# EasyEDA Pro project PCB-WirelessCharging.eprj

# Schematic Schematic1
Board Name: Board1; Create Date: 2025-05-07
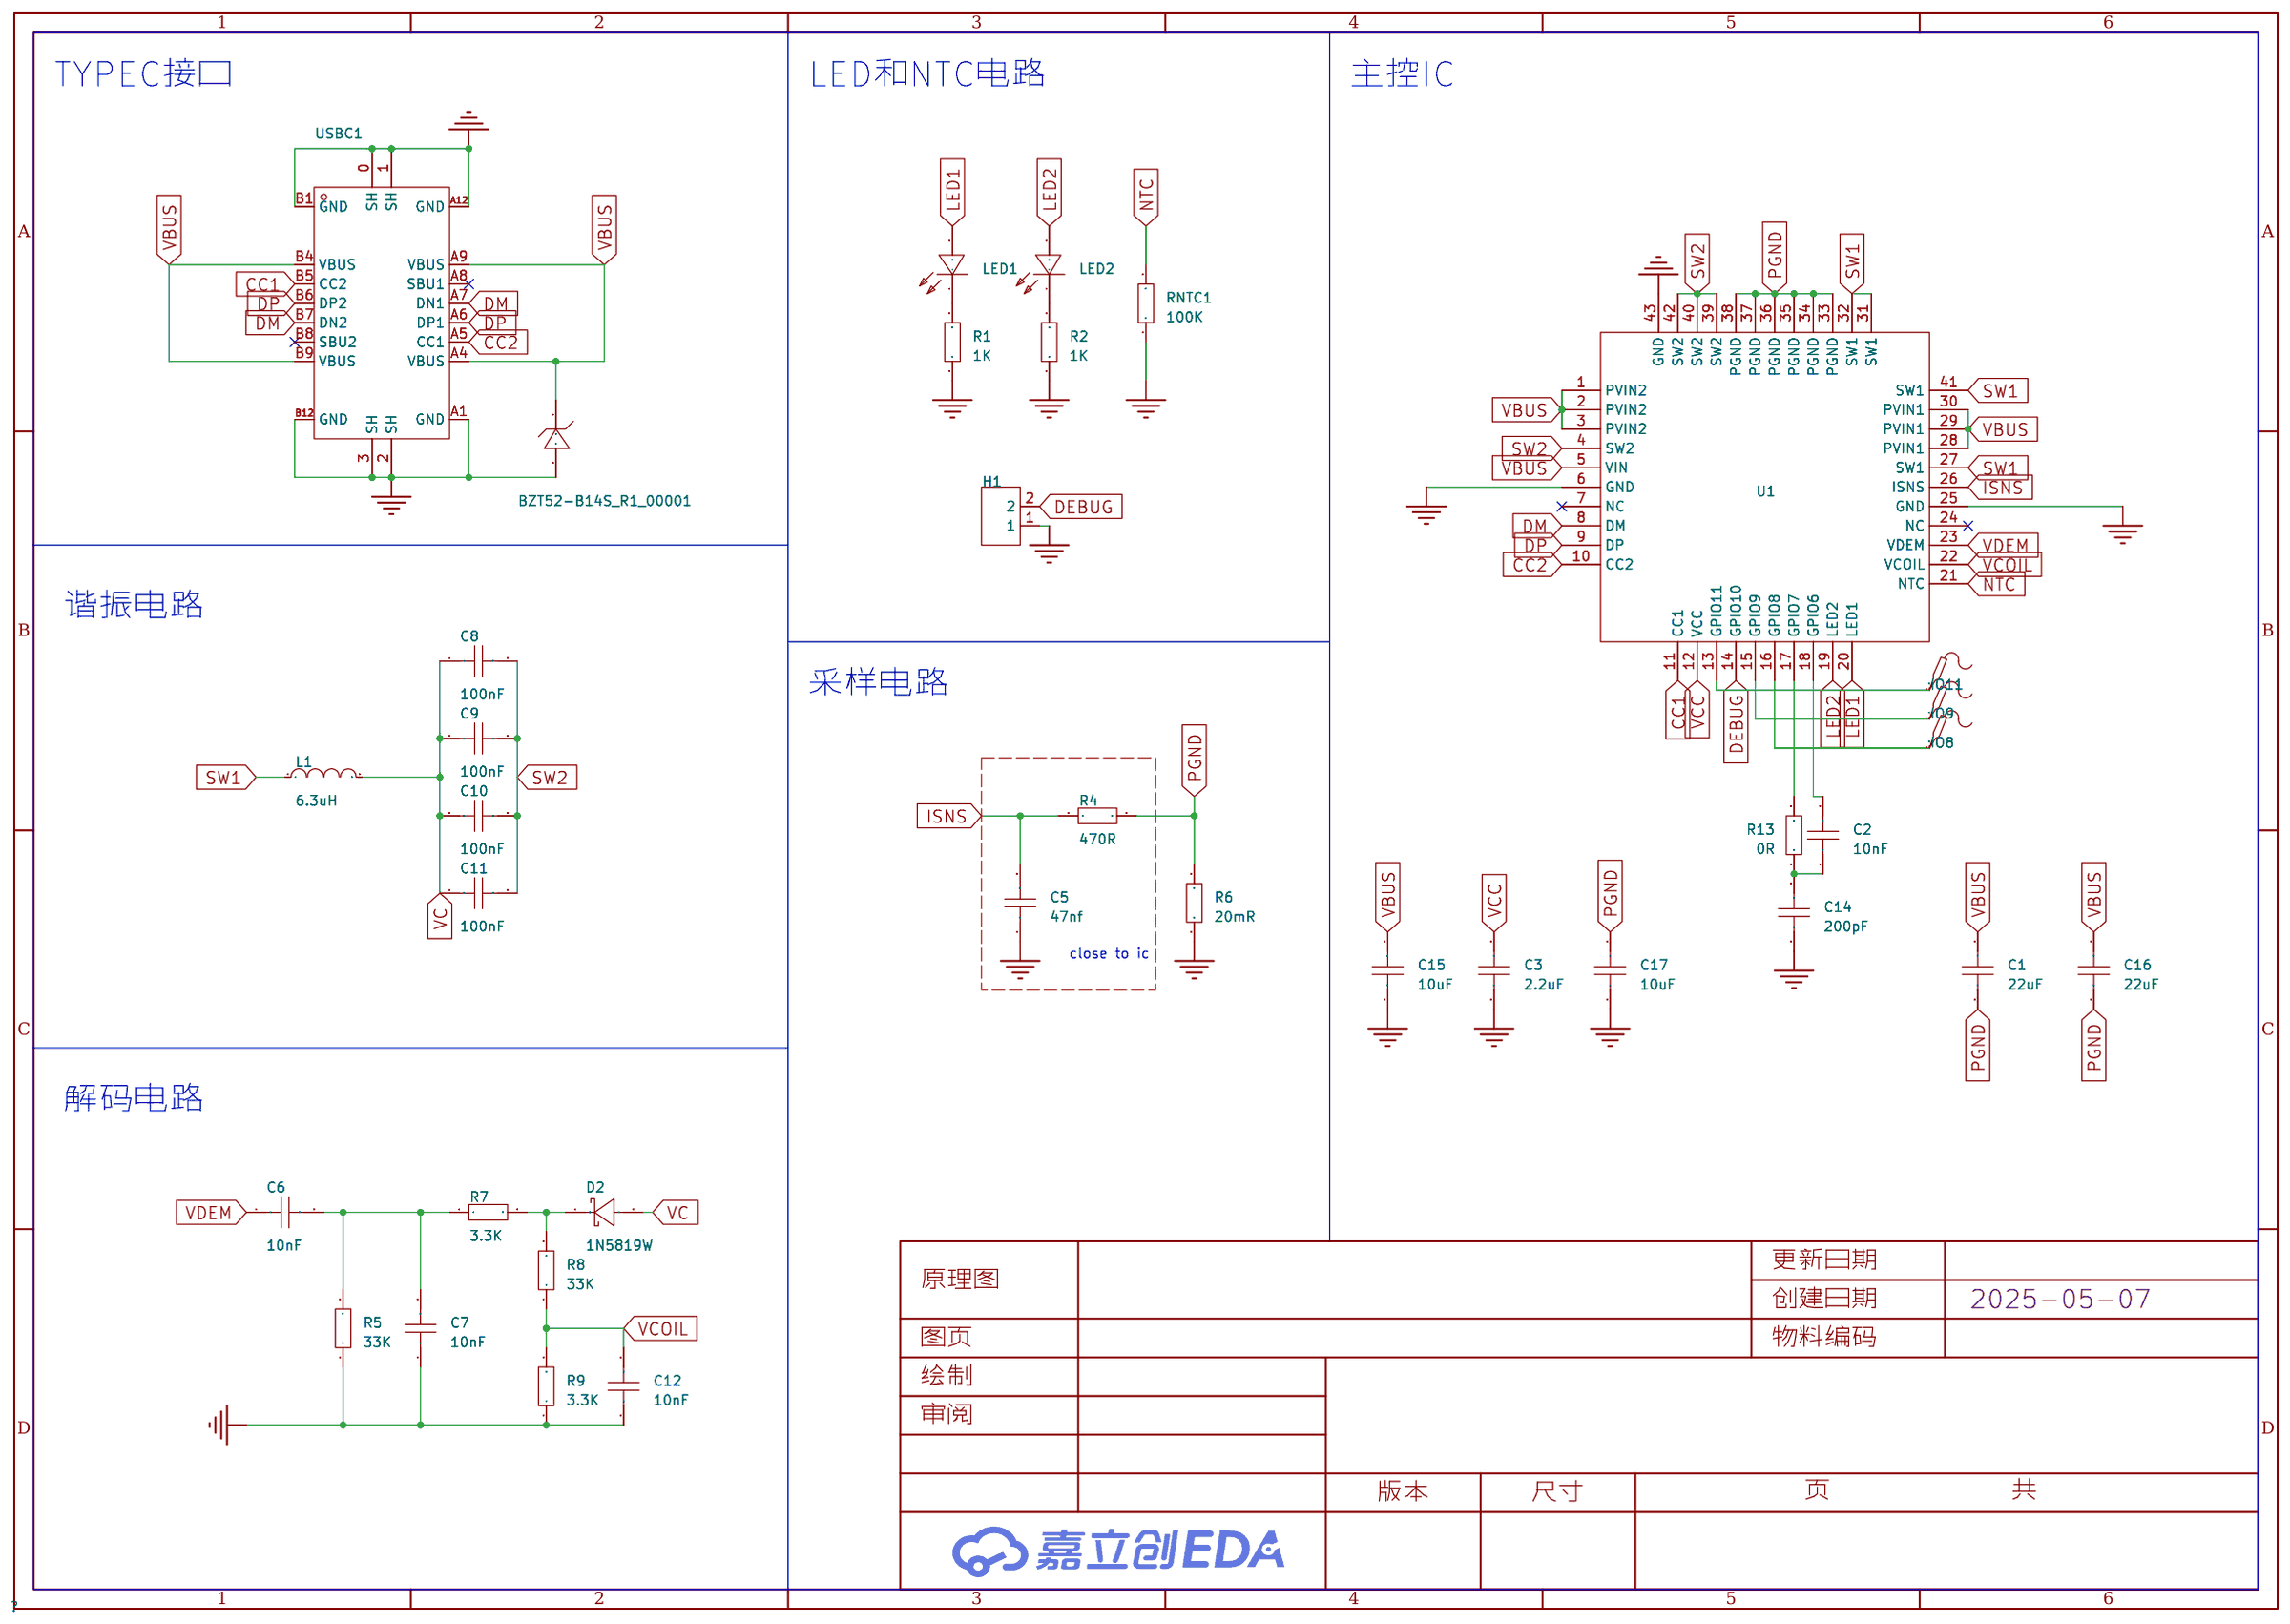
[diagram p0: schematic sheet]

## Parts
C1  22uF  [C0805]
C2  10nF  [C0603]
C3  2.2uF  [C0603]
C5  47nf  [C0603]
C6  10nF  [C0603]
C7  10nF  [C0603]
C8  100nF  [C1206]
C9  100nF  [C1206]
C10  100nF  [C1206]
C11  100nF  [C1206]
C12  10nF  [C0603]
C14  200pF  [C0603]
C15  10uF  [C0603]
C16  22uF  [C0805]
C17  10uF  [C0603]
D1  BZT52-B14S_R1_00001  [SOD-323_L1.9-W1.3-LS2.5-RD-1]
D2  1N5819W  [SOD-123_L2.7-W1.6-LS3.7-RD]
H1  PZ254V-11-02P  [HDR-TH_2P-P2.54-V-M]
IO8  -  [Test-Point-0.5mm]
IO9  -  [Test-Point-0.5mm]
IO11  -  [Test-Point-0.5mm]
L1  6.3uH  [IND-SMD_L4.5-W3.0]
LED1  LTST-C190KSKT  [LED0603-RD]
LED2  LTST-C190KSKT  [LED0603-RD]
R1  1K  [R0603]
R2  1K  [R0603]
R4  470R  [R0603]
R5  33K  [R0603]
R6  20mR  [R1206_1]
R7  3.3K  [R0603]
R8  33K  [R0603]
R9  3.3K  [R0603]
R13  0R  [R0603]
RNTC1  100K  [R0603]
U1  -  [IP6824]
USBC1  TYPE-C-31-M-12  [USB-C_SMD-TYPE-C-31-M-12]

## Library data of the parts
C1-C3 C5-C12 C14-C17 = CAP_0603: Supplier Footprint: 0603
D1 = BZT52-B14S_R1_00001: Supplier Part: C393420; Manufacturer: PANJIT(强茂); Supplier Footprint: SOD-323; JLCPCB Part Class: 扩展库; Datasheet: https://atta.szlcsc.com/upload/public/pdf/source/20190515/C393420_C734830DD542296BD43D073F6F92D8B1.pdf; Supplier: LCSC; Diode Configuration: 独立式; Zener Voltage (Nom): 14V; Reverse Leakage Current (Ir): 100nA@10.5V; Zener Voltage (Range): 13.72V~14.28V; Power Dissipation: 200mW; Zener Impedance (Zzt): 25Ω; Tolerance: ±2%
D2 = 1N5819W_C963381: LCSC Part Name: 电压:40V 电流:350mA; Supplier Part: C963381; Manufacturer: JSMSEMI(杰盛微); Supplier Footprint: SOD-123; JLCPCB Part Class: 扩展库; Datasheet: https://atta.szlcsc.com/upload/public/pdf/source/20230807/ADD53622154D5B572F84A7B877E922CE.pdf; Supplier: LCSC; Diode Configuration: 独立式; Forward Voltage (Vf@If): 600mV@200mA; Reverse Voltage (Vr): 40V; Rectified Current: 350mA; Reverse Leakage Current (Ir): 5uA@30V
H1 = PZ254V-11-02P: LCSC Part Name: 1x2P 间距:2.54mm 方针 直插; Supplier Part: C492401; Manufacturer: XFCN(兴飞); Supplier Footprint: 插件,P=2.54mm; JLCPCB Part Class: 扩展库; Datasheet: https://atta.szlcsc.com/upload/public/pdf/source/20200309/C492401_A812433581A9B211A7FFA413ADDFF0E5.pdf; Supplier: LCSC; Pin Structure: 1x2P; Pitch: 2.54mm; Circluar Pins/Square Pins: 方针; Mounting Type: 直插; Number of Rows: 单排; Number of Pins: 2P; Length of Mating Pin: 6mm; Insulation Height: 2.5mm; Length of End Connection Pin: 3mm; Contact Material: 黄铜; Operating Temperature: -40℃~+105℃; Color: 黑色
IO8 IO9 IO11 = Test-Point
L1 = L_0603: Supplier Footprint: L0603
LED1 LED2 = LTST-C190KSKT: LCSC Part Name: 黄灯; Supplier Part: C125095; Manufacturer: LITEON(光宝); Supplier Footprint: 0603; JLCPCB Part Class: 扩展库; Datasheet: https://atta.szlcsc.com/upload/public/pdf/source/20180129/C125095_15171881843821315881.pdf; Supplier: LCSC; Emitted Color: 黄色; Forward Voltage (VF): 2.1V; Power Dissipation: 75mW; Forward Current: 20mA; Dominant Wavelength: 584.5nm~597nm; Peak Wavelength: 588nm; Lens Color: 无色透明透镜; Luminous Intensity: 104mcd; Viewing Angle: 130°; Operating Temperature: -30℃~+85℃
R1 R2 R4-R9 R13 RNTC1 = Res_0603: Supplier Footprint: 0603
U1 = IP6824
USBC1 = TYPE-C-31-M-12: LCSC Part Name: Type-C 母; Supplier Part: C165948; Manufacturer: 韩国韩荣; Supplier Footprint: SMD; JLCPCB Part Class: 扩展库; Datasheet: https://atta.szlcsc.com/upload/public/pdf/source/20220525/466408E853115E789EDB0DDC29077C05.pdf; Supplier: LCSC; Connector Type: Type-C; Gender: 母; Number of Contacts: 16P; Number of Ports: 1; Current Rating - Power (Max): 5A

## Nets
GND: C3.1 C5.1 C7.1 C12.1 C14.1 C15.1 C17.1 D1.2(A) H1.1 R1.1 R2.1 R5.1 R6.1 R9.1 RNTC1.1 U1.6(GND) U1.25(GND) U1.43(GND) USBC1.0(SH) USBC1.1(SH) USBC1.2(SH) USBC1.3(SH) USBC1.A1(GND) USBC1.A12(GND) USBC1.B1(GND) USBC1.B12(GND)
PGND: C1.1 C16.1 C17.2 R4.2 R6.2 U1.33(PGND) U1.34(PGND) U1.35(PGND) U1.36(PGND) U1.37(PGND) U1.38(PGND)
VBUS: C1.2 C15.2 C16.2 D1.1(C) U1.1(PVIN2) U1.2(PVIN2) U1.3(PVIN2) U1.5(VIN) U1.28(PVIN1) U1.29(PVIN1) U1.30(PVIN1) USBC1.A4(VBUS) USBC1.A9(VBUS) USBC1.B4(VBUS) USBC1.B9(VBUS)
VCC: C3.2 U1.12(VCC)
CC1: U1.11(CC1) USBC1.B5(CC2)
CC2: U1.10(CC2) USBC1.A5(CC1)
DEBUG: H1.2 U1.14(GPIO10)
DM: U1.8(DM) USBC1.A7(DN1) USBC1.B7(DN2)
DP: U1.9(DP) USBC1.A6(DP1) USBC1.B6(DP2)
ISNS: C5.2 R4.1 U1.26(ISNS)
LED1: LED1.2(+) U1.20(LED1)
LED2: LED2.2(+) U1.19(LED2)
NTC: RNTC1.2 U1.21(NTC)
SW1: L1.1 U1.27(SW1) U1.31(SW1) U1.32(SW1) U1.41(SW1)
SW2: C8.2 C9.2 C10.2 C11.2 U1.4(SW2) U1.39(SW2) U1.40(SW2) U1.42(SW2)
VC: C8.1 C9.1 C10.1 C11.1 D2.2(A) L1.2
VCOIL: C12.2 R8.1 R9.2 U1.22(VCOIL)
VDEM: C6.1 U1.23(VDEM)
$1N1712: IO8.1 U1.16(GPIO8)
$1N1716: IO9.1 U1.15(GPIO9)
$1N1721: IO11.1 U1.13(GPIO11)
$1N1775: R13.2 U1.17(GPIO7)
$1N1830: C2.2 U1.18(GPIO6)
$1N1835: C2.1 C14.2 R13.1
$1N3496: C6.2 C7.2 R5.2 R7.1
$1N3523: D2.1(C) R7.2 R8.2
$1N4406: LED1.1(-) R1.2
$1N4454: LED2.1(-) R2.2

Not connected (* = marked no-connect by the designer): U1 7(NC)* 24(NC)*; USBC1 A8(SBU1)* B8(SBU2)*

## Notes on the sheet
- TYPEC接口
- LED和NTC电路
- 主控IC
- 谐振电路
- 采样电路
- close to ic
- 解码电路

# Schematic Schematic2
Board Name: 接收端; Create Date: 2025-06-30
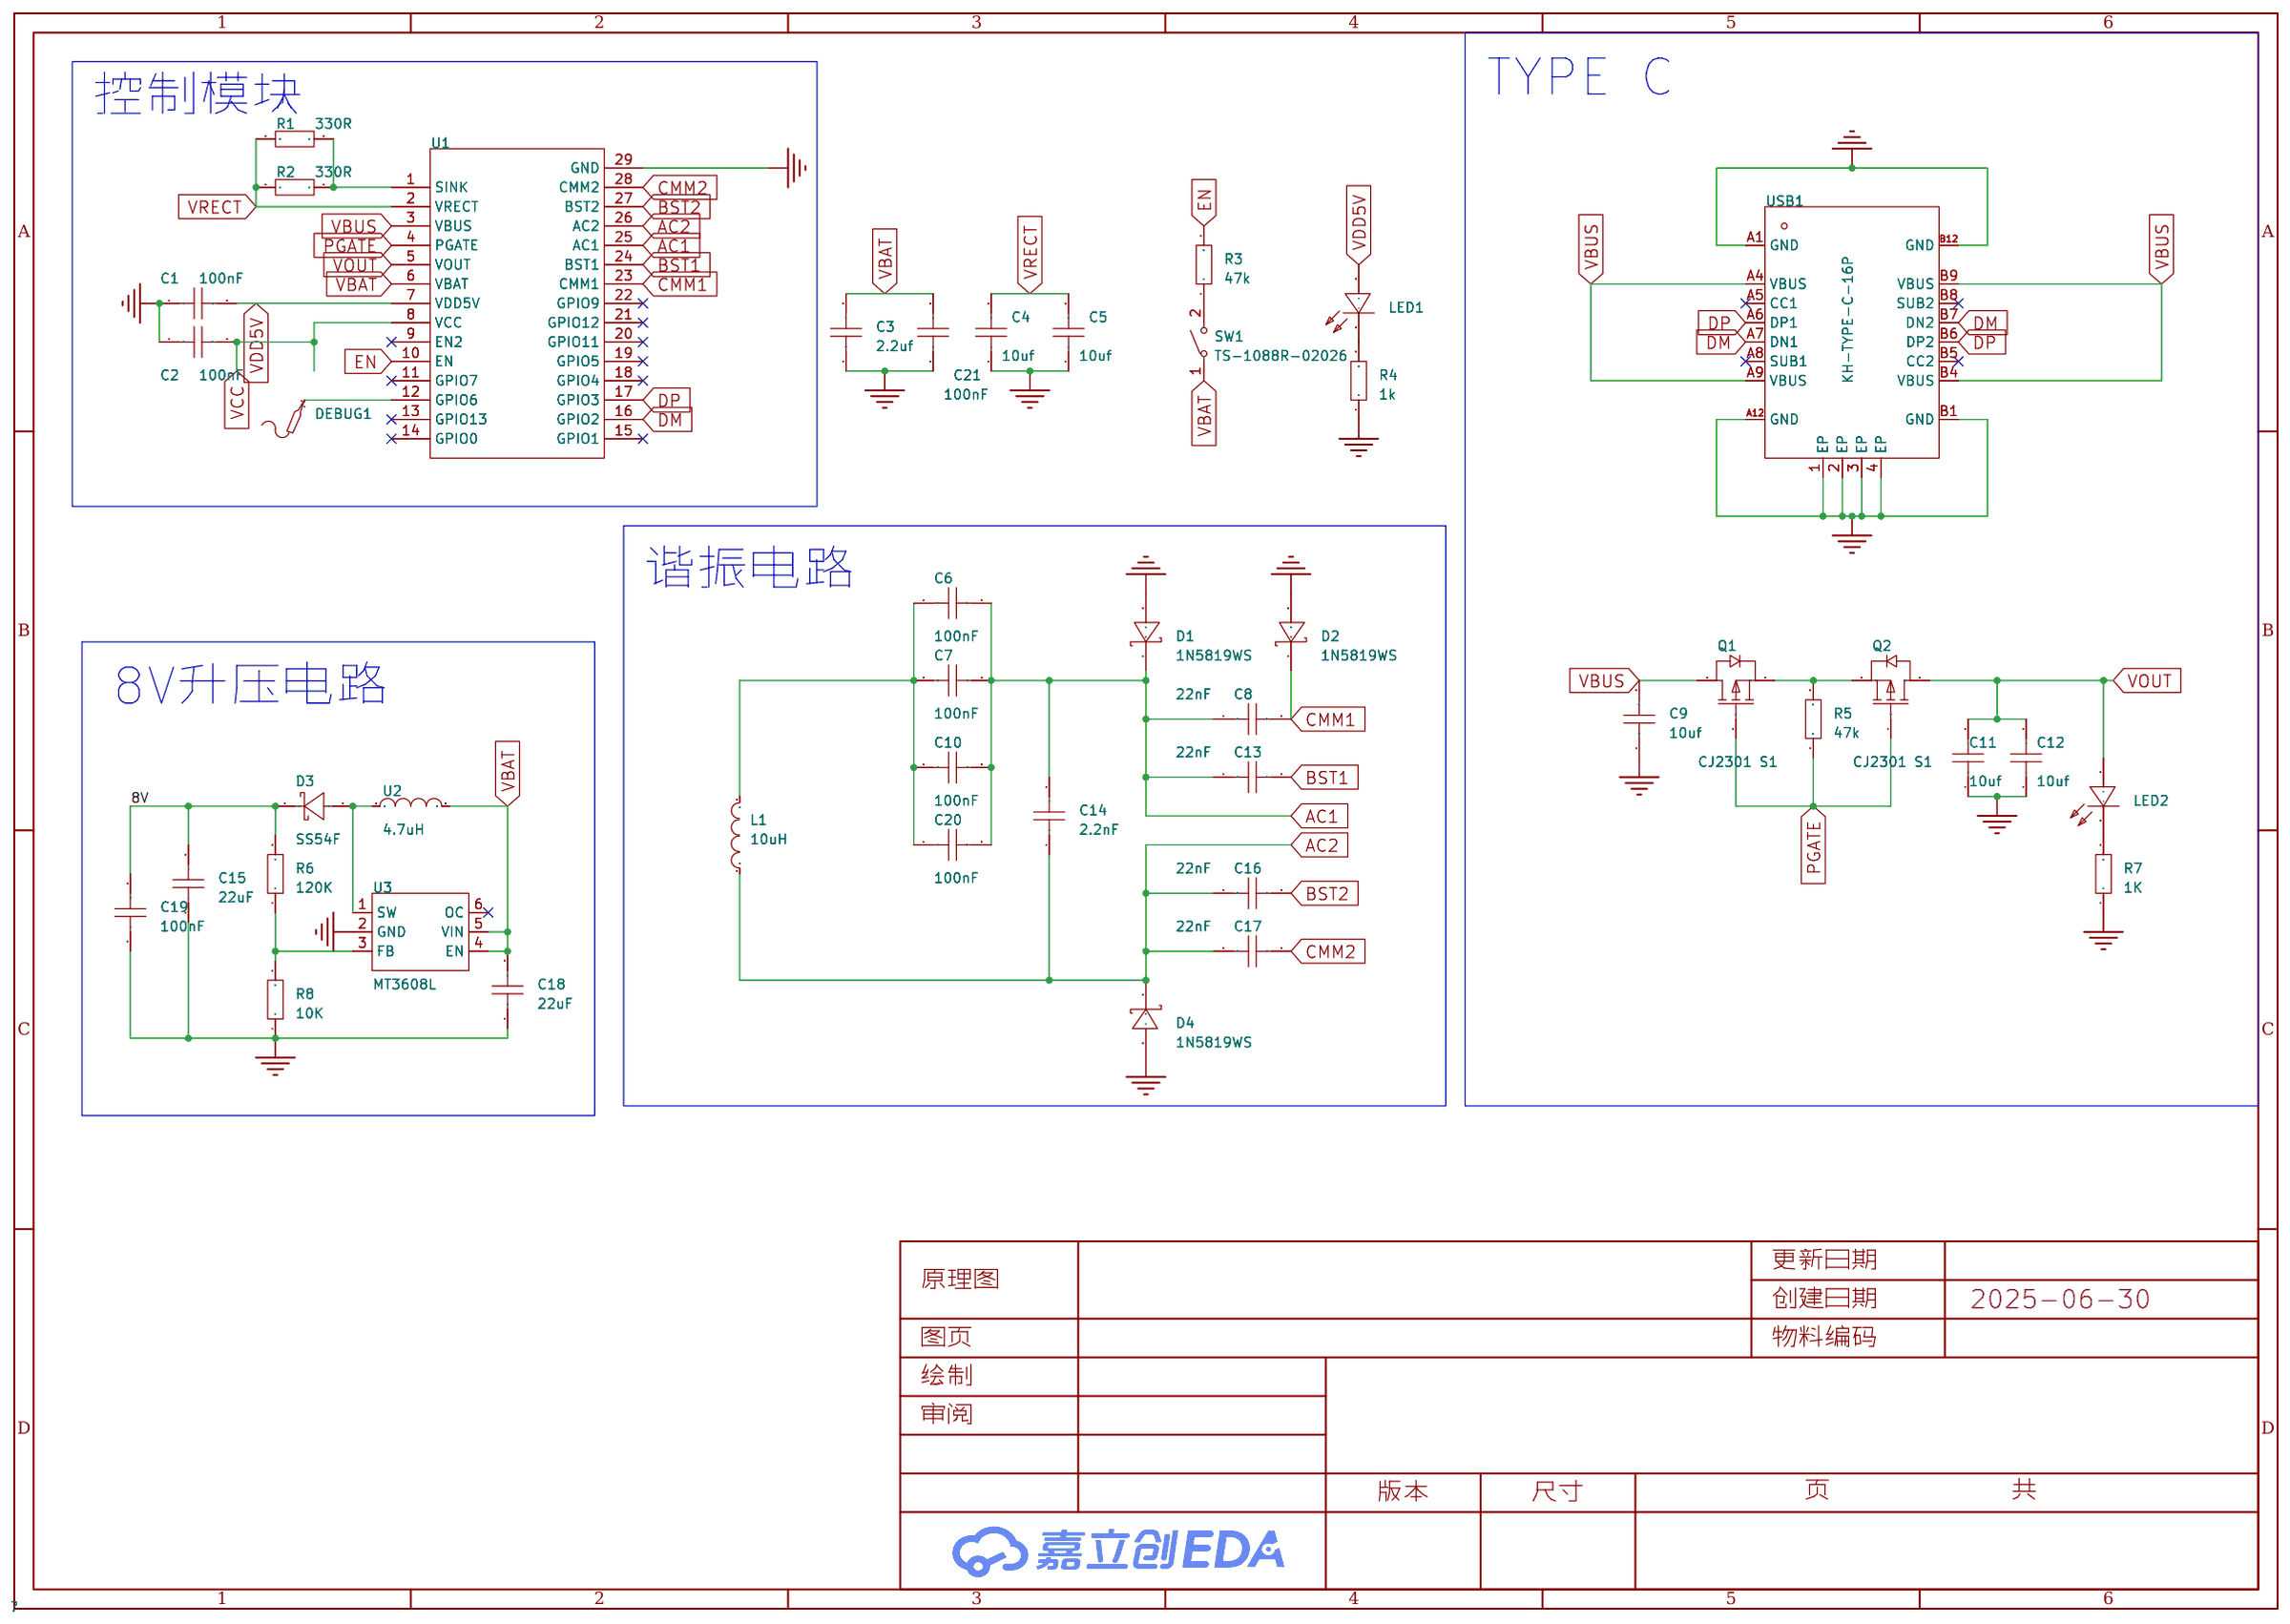
[diagram p1: schematic sheet]

## Parts
C1  100nF  [C0603]
C2  100nF  [C0603]
C3  2.2uf  [C0603]
C4  10uf  [C0603]
C5  10uf  [C0603]
C6  100nF  [C0603]
C7  100nF  [C0603]
C8  22nF  [C0603]
C9  10uf  [C0603]
C10  100nF  [C0603]
C11  10uf  [C0603]
C12  10uf  [C0603]
C13  22nF  [C0603]
C14  2.2nF  [C0603]
C15  22uF  [C0805]
C16  22nF  [C0603]
C17  22nF  [C0603]
C18  22uF  [C0805]
C19  100nF  [C0603]
C20  100nF  [C0603]
C21  100nF  [C0603]
D1  1N5819WS  [SOD-323_L1.8-W1.3-LS2.5-RD]
D2  1N5819WS  [SOD-323_L1.8-W1.3-LS2.5-RD]
D3  SS54F  [SMAF_L3.5-W2.6-LS4.7-RD-1]
D4  1N5819WS  [SOD-323_L1.8-W1.3-LS2.5-RD]
DEBUG1  -  [Test-Point-0.5mm]
L1  10uH  [L0603]
LED1  LTST-C190KSKT  [LED0603-RD]
LED2  LTST-C190KSKT  [LED0603-RD]
Q1  CJ2301 S1  [SOT-23-3_L3.0-W1.7-P0.95-LS2.9-BR]
Q2  CJ2301 S1  [SOT-23-3_L3.0-W1.7-P0.95-LS2.9-BR]
R1  330R  [R0805]
R2  330R  [R0805]
R3  47k  [R0603]
R4  1k  [R0603]
R5  47k  [R0603]
R6  120K  [R0603]
R7  1K  [R0603]
R8  10K  [R0603]
SW1  TS-1088R-02026  [SW-SMD_L3.9-W3.0-P4.45]
U1  -  [IP6833]
U2  4.7uH  [IND-SMD_L4.4-W4.2]
U3  MT3608L  [SOT-23-6_L2.9-W1.6-P0.95-LS2.8-BL_3]
USB1  KH-TYPE-C-16P  [USB-C-SMD_KH-TYPE-C-16P]

## Library data of the parts
C1-C21 = CAP_0603: Supplier Footprint: 0603
D1 D2 D4 = 1N5819WS_C191023: LCSC Part Name: 电压:40V 电流:1A; Supplier Part: C191023; Manufacturer: Hottech(合科泰); Supplier Footprint: SOD-323; JLCPCB Part Class: 基础库; Datasheet: https://atta.szlcsc.com/upload/public/pdf/source/20220428/3CB86FD8D28D653594B4E35F9D5AEFD9.pdf; Supplier: LCSC; Forward Voltage (Vf@If): 600mV@1A; Reverse Voltage (Vr): 40V; Rectified Current: 1A
D3 = SS54F_C18199179: LCSC Part Name: 电压:40V 电流:5A; Supplier Part: C18199179; Manufacturer: 宏嘉诚; Supplier Footprint: SMAF; JLCPCB Part Class: 扩展库; Datasheet: https://atta.szlcsc.com/upload/public/pdf/source/20250121/FDB92513849E10B53DCF948A58635644.pdf; Supplier: LCSC; Diode Configuration: 独立式; Voltage - Forward(Vf@If): 550mV@5.0A; Voltage - DC Reverse(Vr): 40V; Current - Rectified: 5A; Reverse Leakage Current (Ir): 200uA@40V
DEBUG1 = Test-Point
L1 = L_0603
LED1 LED2 = LTST-C190KSKT: LCSC Part Name: 黄灯; Supplier Part: C125095; Manufacturer: LITEON(光宝); Supplier Footprint: 0603; JLCPCB Part Class: 扩展库; Datasheet: https://atta.szlcsc.com/upload/public/pdf/source/20180129/C125095_15171881843821315881.pdf; Supplier: LCSC; Emitted Color: 黄色; Forward Voltage (VF): 2.1V; Power Dissipation: 75mW; Forward Current: 20mA; Dominant Wavelength: 584.5nm~597nm; Peak Wavelength: 588nm; Lens Color: 无色透明透镜; Luminous Intensity: 104mcd; Viewing Angle: 130°; Operating Temperature: -30℃~+85℃
Q1 Q2 = CJ2301 S1: LCSC Part Name: 1个P沟道 耐压:20V 电流:2.3A; Supplier Part: C8547; Manufacturer: CJ(江苏长电/长晶); Supplier Footprint: SOT-23; JLCPCB Part Class: 扩展库; Datasheet: https://atta.szlcsc.com/upload/public/pdf/source/20140815/1457707224119.pdf; Supplier: LCSC; Type: 1个P沟道; Drain to Source Voltage: 20V; Current - Continuous Drain(Id): 2.3A; RDS(on): 142mΩ@2.5V,2A; Pd - Power Dissipation: 350mW; Gate Threshold Voltage (Vgs(th)@Id): 1V; Input Capacitance(Ciss@Vds): 405pF@10V; Operating Temperature: -55℃~+150℃
R1-R8 = Res_0603: Supplier Footprint: 0603
SW1 = TS-1088R-02026: LCSC Part Name: 3.9*2.93*2mm 立贴 轻触开关; Supplier Part: C455280; Manufacturer: XUNPU(讯普); Supplier Footprint: SMD,3x4mm; JLCPCB Part Class: 扩展库; Datasheet: https://atta.szlcsc.com/upload/public/pdf/source/20191118/C455281_EC5379764BC1462550DF64BBBFEA9579.pdf; Supplier: LCSC; Circuit: 单刀单掷; Actuator Style: 圆形按钮; Mounting Style: 立贴; Switch Length: 3.9mm; Switch Width: 2.93mm; Switch Height: 2mm; Contact Current: 50mA; Voltage Rating (DC): 12V
U1 = IP6833
U2 = XR0420-4R7M: LCSC Part Name: 4.7uH ±20% 3A; Supplier Part: C5307591; Manufacturer: XR(祥如); Supplier Footprint: SMD,0420; JLCPCB Part Class: 扩展库; Datasheet: https://atta.szlcsc.com/upload/public/pdf/source/20240328/110B611B724D24AB51078DA8F677E482.pdf; Supplier: LCSC; Tolerance: ±20%; Current Rating: 2.8A; Current - Saturation(Isat): 3A; DC Resistance(DCR): 105mΩ; Type: 一体成型电感
U3 = MT3608L: LCSC Part Name: 高效2.5A 1.2MHz升压转换器; Supplier Part: C2932326; Manufacturer: 西安航天民芯; Supplier Footprint: SOT-23-6; JLCPCB Part Class: 扩展库; Datasheet: https://atta.szlcsc.com/upload/public/pdf/source/20211213/953A62CC1033762E00AABAD4906DD7F1.pdf; Supplier: LCSC; Function: 升压型; Output Type: 可调; Voltage - Supply: 2.2V~16V; Output Current: 2.5A; Frequency - Switching: 1.2MHz; Operating Temperature: -40℃~+85℃@(TA); Synchronous Rectifier: 否; Number of Outputs: 1; Topology: 升压式; Quiescent Current: 100uA; Switch tube (built-in/external): 内置
USB1 = KH-TYPE-C-16P: LCSC Part Name: Type-C 母 卧贴; Supplier Part: C709357; Manufacturer: kinghelm(金航标); Supplier Footprint: SMD; JLCPCB Part Class: 扩展库; Datasheet: https://atta.szlcsc.com/upload/public/pdf/source/20200911/C709357_AA8DCEB38BB20E3035A7ED7AE7667837.pdf; Supplier: LCSC; Connector Type: Type-C; Gender: 母; Number of Ports: 1; Number of Contacts: 16P; Mounting Style: 卧贴; Current Rating - Power (Max): 3A; Operating Temperature Range: -40℃~+85℃

## Nets
8V: C15.2 C19.2 D3.1(K) R6.2
GND: C1.1 C2.1 C3.1 C4.1 C5.1 C9.1 C11.1 C12.1 C15.1 C18.1 C19.1 C21.1 D1.2(A) D2.2(A) D4.2(A) R4.1 R7.1 R8.1 U1.29(GND) U3.2(GND) USB1.1(EP) USB1.2(EP) USB1.3(EP) USB1.4(EP) USB1.A1(GND) USB1.A12(GND) USB1.B1(GND) USB1.B12(GND)
VBAT: C3.2 C18.2 C21.2 SW1.1 U1.6(VBAT) U2.2 U3.4(EN) U3.5(VIN)
VBUS: C9.2 Q1.3(D) U1.3(VBUS) USB1.A4(VBUS) USB1.A9(VBUS) USB1.B4(VBUS) USB1.B9(VBUS)
VCC: C2.2 U1.8(VCC)
VDD5V: C1.2 LED1.2(+) U1.7(VDD5V)
AC1: C6.2 C7.2 C8.1 C10.2 C13.1 C14.2 C20.2 D1.1(K) U1.25(AC1)
AC2: C14.1 C16.1 C17.1 D4.1(K) L1.1 U1.26(AC2)
BST1: C13.2 U1.24(BST1)
BST2: C16.2 U1.27(BST2)
CMM1: C8.2 D2.1(K) U1.23(CMM1)
CMM2: C17.2 U1.28(CMM2)
DM: U1.16(GPIO2) USB1.A7(DN1) USB1.B7(DN2)
DP: U1.17(GPIO3) USB1.A6(DP1) USB1.B6(DP2)
EN: R3.2 U1.10(EN)
PGATE: Q1.1(G) Q2.1(G) R5.1 U1.4(PGATE)
VOUT: C11.2 C12.2 LED2.2(+) Q2.3(D) U1.5(VOUT)
VRECT: C4.2 C5.2 R1.2 R2.2 U1.2(VRECT)
$1N1926: R1.1 R2.1 U1.1(SINK)
$1N1936: DEBUG1.1 U1.12(GPIO6)
$1N1945: C6.1 C7.1 C10.1 C20.1 L1.2
$1N1962: Q1.2(S) Q2.2(S) R5.2
$1N1968: LED2.1(-) R7.2
$1N1977: LED1.1(-) R4.2
$1N1985: D3.2(A) U2.1 U3.1(SW)
$1N1994: R6.1 R8.2 U3.3(FB)
$1N3112: R3.1 SW1.2

Not connected (* = marked no-connect by the designer): U1 9(EN2)* 11(GPIO7)* 13(GPIO13)* 14(GPIO0)* 15(GPIO1)* 18(GPIO4)* 19(GPIO5)* 20(GPIO11)* 21(GPIO12)* 22(GPIO9)*; U3 6(OC)*; USB1 A5(CC1)* A8(SUB1)* B5(CC2)* B8(SUB2)*

## Notes on the sheet
- TYPE C
- 控制模块
- 谐振电路
- 8V升压电路

# Board PCB1
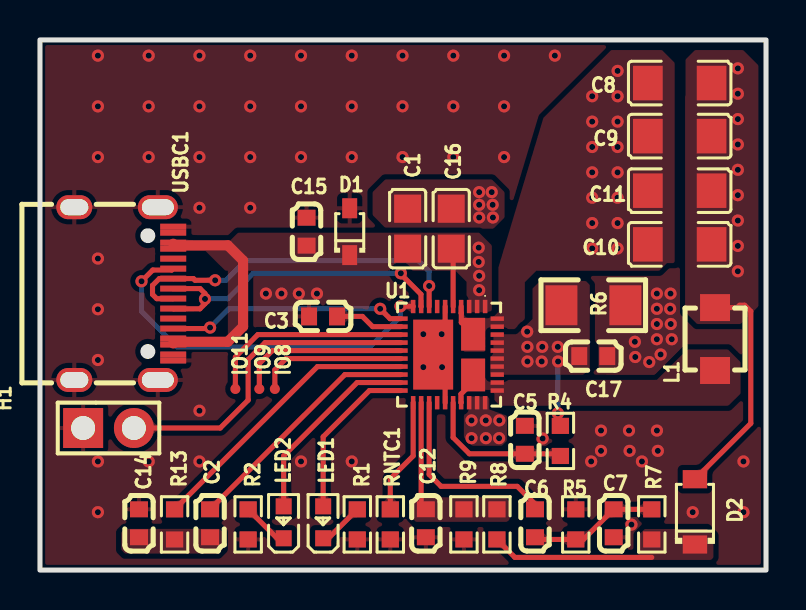
[diagram p2: board, top side]
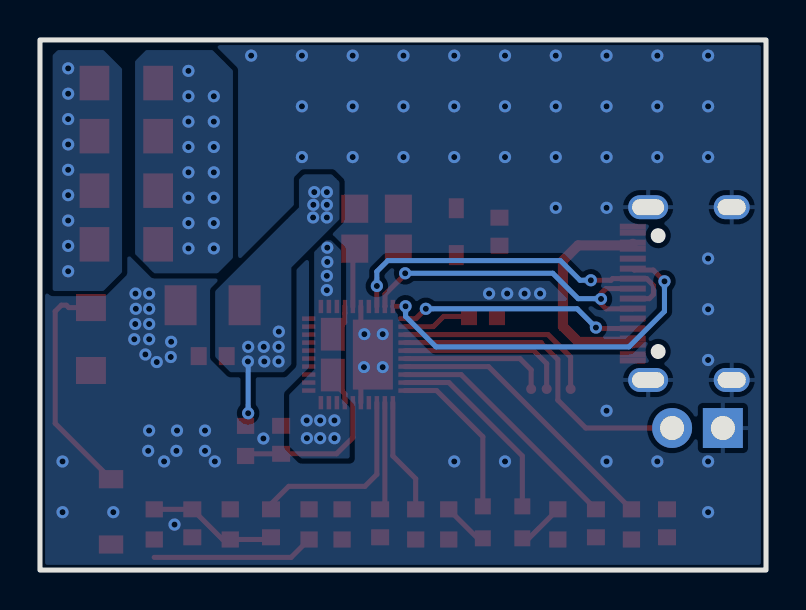
[diagram p3: board, bottom side, seen from below]

Outline 36.32 x 26.54 mm; copper layers: Top Layer, Bottom Layer. Coordinates in mm from the lower left corner of the outline.
Outline path: rectangle 0,26.54 36.32,0
Stack: Top Layer 0.035mm / Dielectric1 1.51mm FR4 er 4.5 / Bottom Layer 0.035mm

## Design rules (mm)
template: 自定义配置
spacing copperThickness1oz (default): track to track 0.102, other pairs 0.152 to 0.3
spacing copperThickness2oz: track to track 0.203, other pairs 0.152 to 0.3
track width copperThickness1oz (default): min 0.127, default 0.254, max 2.54
track width copperThickness2oz: min 0.203, default 0.254, max 2.54
differential pair differentialPair (default): width min 0.127, default 0.254, max 2.54; gap min 0.152, default 0.152
via viaSize (default): diameter min 0.5, default 0.61, max 10; hole min 0.3, default 0.305, max 6.3
pour e39 uses 直连
pour e98 uses 直连
pour e163 uses 直连
pour e203 uses 直连
pour e243 uses 直连
pour e281 uses 直连
pour e300 uses 直连
pour e367 uses 直连
pour e770 uses 直连
pour e1145 uses 直连
pour e1188 uses 直连
pour e1461 uses 直连

## Placement (name value [footprint] x y rotation side)
C1  22uF  [C0805]  18.39 17.09 270 top
C2  10nF  [C0603]  8.51 2.34 90 top
C3  2.2uF  [C0603]  14.16 12.7 0 top
C5  47nf  [C0603]  24.26 6.52 270 top
C6  10nF  [C0603]  24.76 2.34 270 top
C7  10nF  [C0603]  28.7 2.34 90 top
C8  100nF  [C1206]  32 24.38 180 top
C9  100nF  [C1206]  32 21.73 180 top
C10  100nF  [C1206]  32 16.31 180 top
C11  100nF  [C1206]  32 19 180 top
C12  10nF  [C0603]  19.3 2.34 90 top
C14  200pF  [C0603]  4.95 2.34 270 top
C15  10uF  [C0603]  13.34 16.94 270 top
C16  22uF  [C0805]  20.57 17.09 270 top
C17  10uF  [C0603]  27.68 10.71 180 top
D1  BZT52-B14S_R1_00001  [SOD-323_L1.9-W1.3-LS2.5-RD-1]  15.49 16.94 90 top
D2  1N5819W  [SOD-123_L2.7-W1.6-LS3.7-RD]  32.77 2.92 90 top
H1  PZ254V-11-02P  [HDR-TH_2P-P2.54-V-M]  3.43 7.11 0 top
IO8  -  [Test-Point-0.5mm]  11.75 9.07 0 top
IO9  -  [Test-Point-0.5mm]  10.97 9.07 0 top
IO11  -  [Test-Point-0.5mm]  9.78 9.07 0 top
L1  6.3uH  [IND-SMD_L4.5-W3.0]  33.77 11.57 90 top
LED1  LTST-C190KSKT  [LED0603-RD]  14.17 2.39 90 top
LED2  LTST-C190KSKT  [LED0603-RD]  12.19 2.39 90 top
R1  1K  [R0603]  15.88 2.29 90 top
R2  1K  [R0603]  10.41 2.29 90 top
R4  470R  [R0603]  26.03 6.47 90 top
R5  33K  [R0603]  26.81 2.29 270 top
R6  20mR  [R1206_1]  27.69 13.26 180 top
R7  3.3K  [R0603]  30.61 2.29 270 top
R8  33K  [R0603]  22.86 2.29 270 top
R9  3.3K  [R0603]  21.21 2.29 90 top
R13  0R  [R0603]  6.73 2.29 90 top
RNTC1  100K  [R0603]  17.53 2.29 90 top
U1  -  [IP6824]  20.47 10.79 270 top
USBC1  TYPE-C-31-M-12  [USB-C_SMD-TYPE-C-31-M-12]  4.19 13.84 270 top

## Footprints (pads in the part's own frame, mm; a bottom-side part is the same pattern mirrored in y, then rotated)
C0603
  rect 0.8x0.9 smd: 1(-0.7,0) 2(0.7,0)
C0805
  rect 1.41x1.35 smd: 1(-1,0) 2(1,0)
C1206
  rect 1.485x1.728 smd: 1(-1.593,0) 2(1.593,0)
HDR-TH_2P-P2.54-V-M
  rect 2x2 hole 1.2: 1(-1.27,0)
  round 2 hole 1.2: 2(1.27,0)
IND-SMD_L4.5-W3.0
  rect 1.35x1.5 smd: 1(-1.575,0) 2(1.575,0)
IP6824
  rect 0.665x0.224 smd: 1(-2.408,1.8) 2(-2.408,1.4) 3(-2.408,1) 4(-2.408,0.6) 5(-2.408,0.2) 6(-2.408,-0.2) 7(-2.408,-0.6) 8(-2.408,-1) 9(-2.408,-1.4) 10(-2.408,-1.8) 21(2.408,-1.8) 22(2.408,-1.4) 23(2.408,-1) 24(2.408,-0.6) 25(2.408,-0.2) 26(2.408,0.2) 27(2.408,0.6) 28(2.408,1) 29(2.408,1.4) 30(2.408,1.8)
  rect 0.224x0.665 smd: 11(-1.8,-2.408) 12(-1.4,-2.408) 13(-1,-2.408) 14(-0.6,-2.408) 15(-0.2,-2.408) 16(0.2,-2.408) 17(0.6,-2.408) 18(1,-2.408) 19(1.4,-2.408) 20(1.8,-2.408) 31(1.8,2.408) 32(1.4,2.408) 33(1,2.408) 34(0.6,2.408) 35(0.2,2.408) 36(-0.2,2.408) 37(-0.6,2.408) 38(-1,2.408) 39(-1.4,2.408) 40(-1.8,2.408)
  rect 1.64x1.2 smd: 41(1.02,1.2) 42(-1.02,1.2)
  rect 3.5x2 smd: 43(0,-0.8)
LED0603-RD
  rect 0.8x0.8 smd: 1(-0.799,0) 2(0.799,0)
R0603
  rect 0.806x0.864 smd: 1(-0.753,0) 2(0.753,0)
R1206_1
  rect 1.6x2 smd: 1(-1.6,0) 2(1.6,0)
SOD-123_L2.7-W1.6-LS3.7-RD
  rect 0.91x1.22 smd: 1(-1.635,0) 2(1.635,0)
SOD-323_L1.9-W1.3-LS2.5-RD-1
  rect 1x0.75 smd: 1(-1.173,0) 2(1.173,0)
Test-Point-0.5mm
  round 0.5 smd: 1(0,0)
USB-C_SMD-TYPE-C-31-M-12
  oval 1.2x2 hole 0.8x1.6: 0(-4.325,1.706) 1(4.325,1.706)
  oval 1.2x1.8 hole 0.8x1.4: 2(4.325,-2.474) 3(-4.325,-2.474)
  rect 0.3x1.3 smd: A1(-3.35,2.474) A4(-2.55,2.474) A5(-1.25,2.474) A6(-0.25,2.474) A7(0.25,2.474) A8(1.25,2.474) A9(2.55,2.474) A12(3.35,2.474) B1(3.05,2.474) B4(2.25,2.474) B5(1.75,2.474) B6(0.75,2.474) B7(-0.75,2.474) B8(-1.75,2.474) B9(-2.25,2.474) B12(-3.05,2.474)

## Nets
As in the schematic.

Pads without a net: U1 7 24; USBC1 A8 B8

## Via types
v1: diameter 0.61, hole 0.305, Top Layer to Bottom Layer, 129 vias

## Routing (per net, layer and track width the routed paths; a pad name or vN(x,y) marks a point on that pad's centre or on a via; arc(x,y) is an arc through that point)
GND: length 5.3
  Top Layer w0.254: U1.25 20.27,10.19 U1.43 20.27,11.39 U1.6
  vias: v1(2.9,25.76) v1(2.9,23.22) v1(2.9,20.68) v1(2.9,15.6) v1(2.9,13.06) v1(2.9,10.52) v1(2.9,5.44) v1(2.9,2.9) v1(5.44,25.76) v1(5.44,23.22) v1(5.44,20.68) v1(5.44,5.44) v1(7.98,25.76) v1(7.98,23.22) v1(7.98,20.68) v1(7.98,18.14) v1(7.98,7.98) v1(7.98,5.44) v1(10.52,25.76) v1(10.52,23.22) v1(10.52,20.68) v1(10.52,18.14) v1(11.3,13.84) v1(12.08,13.84) v1(12.95,13.84) v1(13.06,25.76) v1(13.06,23.22) v1(13.06,20.68) v1(13.06,5.44) v1(13.86,13.84) v1(15.6,25.76) v1(15.6,23.22) v1(15.6,20.68) v1(15.6,5.44) v1(18.14,25.76) v1(18.14,23.22) v1(18.14,20.68) v1(19.18,11.81) v1(19.18,10.16) v1(20.09,11.81) v1(20.12,10.16) v1(20.68,25.76) v1(20.68,23.22) v1(20.68,20.68) v1(23.22,25.76) v1(23.22,23.22) v1(23.22,20.68) v1(25.15,6.59) v1(25.76,25.76) v1(27.57,5.44) v1(28.07,6.98) v1(28.07,5.97) v1(29.47,6.98) v1(29.5,5.97) v1(29.59,2.28) v1(29.76,11.43) v1(29.78,10.67) v1(30.11,5.44) v1(30.48,10.41) v1(30.86,13.84) v1(30.86,13.08) v1(30.86,12.32) v1(30.86,11.56) v1(30.86,6.98) v1(30.91,5.97) v1(31.05,10.8) v1(31.54,13.84) v1(31.53,13.08) v1(31.56,12.32) v1(31.61,11.56) v1(32.65,2.9) v1(35.19,5.44) v1(35.19,2.9)
PGND: length 2.6
  Bottom Layer w0.254: v1(25.92,10.44) 25.91,10.43 v1(25.91,7.85)
  vias: v1(21.97,18.92) v1(21.97,18.29) v1(21.97,17.65) v1(22.6,18.92) v1(22.65,18.29) v1(22.66,17.65) v1(24.37,11.94) v1(24.38,11.18) v1(24.39,10.44) v1(25.13,11.18) v1(25.1,10.44) v1(25.91,11.18)
VBUS: length 13.9
  Top Layer w0.254: C16.2 20.67,16 U1.5
  Top Layer w0.508: 6.66,16.34 6.75,16.26 9.4,16.26 10.16,15.49 10.16,12.19 9.4,11.43 6.75,11.43 6.66,11.35
  vias: v1(21.59,7.49) v1(21.59,6.6) v1(21.95,16.14) v1(21.95,15.43) v1(21.97,14.73) v1(21.97,14.01) v1(22.3,7.49) v1(22.31,6.6) v1(22.98,7.49) v1(22.97,6.6)
VCC: length 3.4
  Top Layer w0.254: C3.2 16.13,12.7 16.64,12.19 U1.12
CC1: length 12
  Top Layer w0.254: v1(8.51,12.14) 8.46,12.09 USBC1.B5 ; v1(17.02,13.08) 17.51,12.59 U1.11
  Bottom Layer w0.254: v1(8.51,12.14) 9.45,13.08 v1(17.02,13.08)
CC2: length 18.8
  Top Layer w0.254: v1(5.08,14.46) 5.64,15.02 6.59,15.02 USBC1.A5 ; v1(18.03,13.21) 18.66,13.21 U1.10
  Bottom Layer w0.254: v1(5.08,14.46) 5.08,12.95 6.86,11.18 16.51,11.18 18.03,12.7 v1(18.03,13.21)
DEBUG: length 16.3
  Top Layer w0.254: U1.14 11.26,11.39 10.41,10.54 10.41,8.51 9.02,7.11 H1.2
DM: length 18
  Top Layer w0.254: v1(8.76,14.51) 7.76,14.51 7.68,14.59 USBC1.B7 5.97,14.59 5.63,14.25 5.63,13.8 5.84,13.59 6.66,13.59 USBC1.A7 ; U1.8 v1(19.47,14.22)
  Bottom Layer w0.254: v1(8.76,14.51) 9.3,14.51 10.29,15.49 18.92,15.49 19.47,14.95 v1(19.47,14.22)
DP: length 16.3
  Top Layer w0.254: USBC1.A6 8,14.09 8.25,13.84 8.25,13.33 8,13.08 6.68,13.08 USBC1.B6 ; U1.9 19.06,13.2 19.06,13.81 18.05,14.81 v1(18.05,14.86)
  Bottom Layer w0.254: v1(18.05,14.86) 10.67,14.86 9.4,13.59 8.27,13.59 v1(8.25,13.57)
ISNS: length 7.5
  Top Layer w0.254: U1.26 20.67,6.64 21.48,5.82 C5.2 25.93,5.82 R4.1
LED1: length 8.3
  Top Layer w0.254: U1.20 16.48,8.99 14.17,6.67 LED1.2
LED2: length 9.9
  Top Layer w0.254: LED2.2 12.19,5.72 15.87,9.39 U1.19
NTC: length 5.8
  Top Layer w0.254: U1.21 18.67,5.72 17.53,4.57 RNTC1.2
SW1: length 1.6
  Top Layer w0.254: U1.41 21.67,9.42 21.06,8.81 21.06,8.39 U1.27
SW2: length 1.6
  Top Layer w0.254: U1.4 21.07,12.87 21.08,12.86 21.08,12.4 U1.42
  vias: v1(27.63,23.72) v1(27.63,22.45) v1(27.63,21.18) v1(27.63,19.91) v1(27.63,18.64) v1(27.63,17.37) v1(27.63,16.1) v1(28.9,24.99) v1(28.9,23.72) v1(28.9,22.45) v1(28.9,21.18) v1(28.9,19.91) v1(28.9,18.64) v1(28.9,17.37) v1(28.9,16.1)
VC: length 11.5
  Top Layer w0.254: L1.2 34.88,13.14 35,13.26 35.25,13.26 35.56,12.95 35.56,7.34 D2.2
  vias: v1(34.91,25.12) v1(34.91,23.85) v1(34.91,22.58) v1(34.91,21.31) v1(34.91,20.04) v1(34.91,18.77) v1(34.91,17.5) v1(34.91,16.23) v1(34.91,14.96)
VCOIL: length 5.4
  Top Layer w0.254: U1.22 19.07,3.28 C12.2
VDEM: length 9.8
  Top Layer w0.254: U1.23 19.47,4.79 20.07,4.19 23.88,4.19 24.76,3.3 C6.1
$1N1712: length 7.5
  Top Layer w0.254: U1.16 12.31,10.59 11.75,10.03 IO8.1
$1N1716: length 8.6
  Top Layer w0.254: IO9.1 10.97,10.34 11.62,10.99 U1.15
$1N1721: length 10.3
  Top Layer w0.254: IO11.1 9.78,10.66 10.9,11.79 U1.13
$1N1775: length 14.3
  Top Layer w0.254: R13.2 13.88,10.19 U1.17
$1N1830: length 12.3
  Top Layer w0.254: U1.18 15.26,9.79 C2.2
$1N3496: length 6.5
  Top Layer w0.254: C6.2 24.87,1.53 R5.2 27.19,1.53 28.7,3.04 C7.2 28.7,3.04 R7.1
$1N3523: length 8.1
  Top Layer w0.254: R8.2 23.76,0.64 30.61,0.64
$1N4406: length 2.3
  Top Layer w0.254: LED1.1 14.43,1.59 R1.2
$1N4454: length 2.4
  Top Layer w0.254: LED2.1 11.86,1.59 R2.2

## Copper pours and planes (outline as drawn; the poured copper is in the pictures)
GND on Top Layer: 27.94,14.1 28.32,14.48 31.62,14.48 32,14.1 32,11.05 30.73,9.78 28.32,9.78 27.94,10.16
GND on Top Layer: -5.97,35.05 47.37,35.05 47.37,-9.53 -5.97,-9.53
GND on Bottom Layer: -10.41,30.35 46.86,30.35 46.86,-6.48 -10.41,-6.48
PGND on Top Layer: 22.61,12.06 22.48,11.94 22.48,9.78 27.19,9.78 27.51,10.1 27.51,14.28 27.31,14.48 25.02,14.48 24.64,14.1 24.64,12.57 24.13,12.06
PGND on Top Layer: 17.31,17.09 22.68,17.09 23.24,17.65 23.24,18.92 22.61,19.56 17.27,19.56 16.64,18.92 16.64,17.78 17.02,17.4 17.02,17.39
PGND on Bottom Layer: 21.34,19.43 21.34,17.56 23.75,15.15 23.75,10.29 24.13,9.91 26.8,9.91 27.56,10.67 27.56,13.97 23.37,18.16 23.37,19.56 23.11,19.81 21.72,19.81
VBUS on Top Layer: 21.21,8.76 22.48,8.76 22.48,8.04 23.37,7.73 23.36,6.47 23.11,6.22 21.46,6.22 21.21,6.48
VBUS on Top Layer: 5.97,16.51 9.53,16.51 9.91,16.89 21.97,16.89 22.61,16.26 22.61,12.83 22.48,12.7 21.46,12.7 21.34,12.83 21.34,14.43 20.78,14.99 9.27,14.99 8.25,16 6.48,16
VBUS on Top Layer: 9.4,15.62 10.16,15.62 10.29,15.49 10.29,12.32 9.4,11.43
VBUS on Bottom Layer: 20.83,5.59 23.24,5.59 23.86,6.2 23.86,8.78 22.61,10.03 22.61,16 22.1,16.51 21.76,16.51 21.26,16.02 21.26,8.59 20.83,8.16
SW1 on Top Layer: 21.08,10.54 21.08,9.02 22.22,9.02 23.01,8.23 34.44,8.23 35.05,8.84 35.05,10.41 34.42,11.05 32.38,11.05 30.86,9.53 22.48,9.53 22.35,9.65 22.35,10.29 22.1,10.54
SW2 on Top Layer: 21.17,12.65 21.17,10.92 22.42,10.92 22.42,11.88 22.61,12.06 23.75,12.06 24.26,12.57 24.26,14.41 24.83,14.99 30.99,14.99 31.37,15.37 31.75,15.37 31.75,25.4 31.12,26.03 28.57,26.03 25.18,22.64 22.93,15.16 22.93,12.93 22.65,12.65
SW2 on Bottom Layer: 26.67,25.02 27.69,26.03 31.01,26.03 31.57,25.48 31.57,15.82 30.61,14.86 27.43,14.86 26.67,15.62
VC on Top Layer: 32.29,25.56 32.77,26.03 35.18,26.03 35.94,25.27 35.94,13.21 35.05,12.32 32.88,12.32 32.27,12.92 32.27,23.75 32.29,23.77
VC on Bottom Layer: 32.21,25.1 33.15,26.03 35.43,26.03 35.69,25.78 35.69,13.97 33.15,13.97 32.21,14.9
VCOIL on Top Layer: 18.9,3.64 23.28,3.64 23.5,3.43 23.5,2.54 23.37,2.41 18.8,2.41 18.59,2.62 18.59,3.33
$1N1835 on Top Layer: 4.24,2.06 8.99,2.06 9.14,1.91 9.14,1.06 8.91,0.82 4.26,0.82 4.06,1.02 4.06,1.88
$1N3523 on Top Layer: 33.37,2.05 33.69,1.73 33.69,0.63 33.57,0.51 30.1,0.51 29.95,0.66 29.95,1.75 30.25,2.05

Small or netless copper shapes (teardrops, artwork), in the pictures only: 41 on Top Layer, 9 on Bottom Layer

# Board PCB3
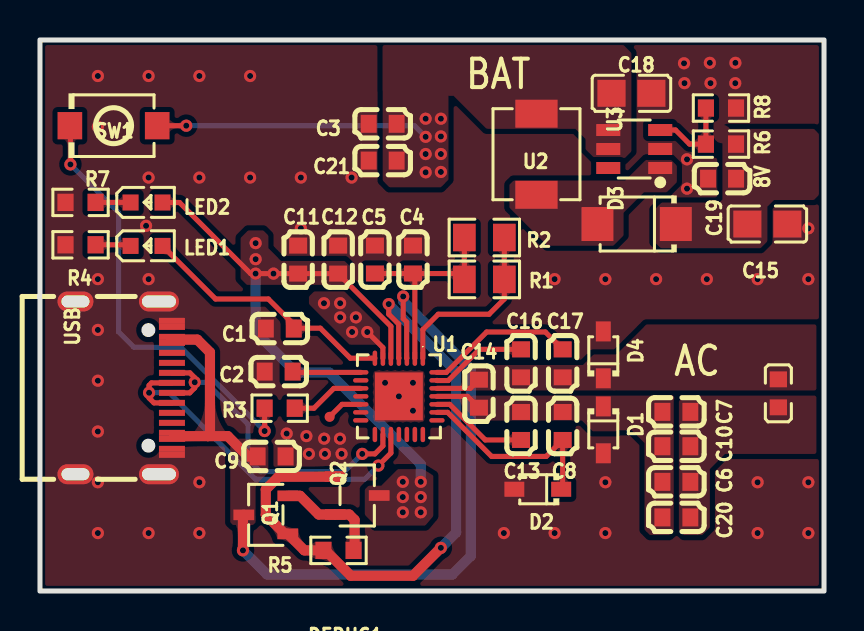
[diagram p4: board, top side]
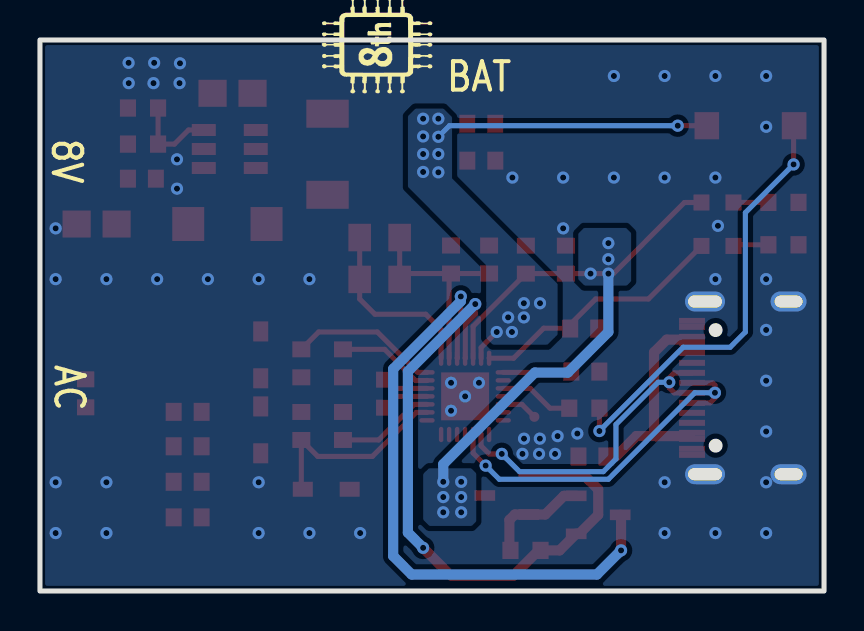
[diagram p5: board, bottom side, seen from below]

Outline 39.24 x 27.56 mm; copper layers: Top Layer, Bottom Layer. Coordinates in mm from the lower left corner of the outline.
Outline path: rectangle 0,27.56 39.24,0
Stack: Top Layer 0.035mm / Dielectric1 1.51mm FR4 er 4.5 / Bottom Layer 0.035mm

## Design rules (mm)
template: 自定义配置
spacing copperThickness1oz (default): track to track 0.102, other pairs 0.152 to 0.3
spacing copperThickness2oz: track to track 0.203, other pairs 0.152 to 0.3
track width copperThickness1oz (default): min 0.127, default 0.254, max 2.54
track width copperThickness2oz: min 0.203, default 0.254, max 2.54
differential pair differentialPair (default): width min 0.127, default 0.254, max 2.54; gap min 0.152, default 0.152
via viaSize (default): diameter min 0.5, default 0.61, max 10; hole min 0.3, default 0.305, max 6.3
pour e5 uses copperRegion

## Placement (name value [footprint] x y rotation side)
C1  100nF  [C0603]  12 13.13 0 top
C2  100nF  [C0603]  11.95 10.97 0 top
C3  2.2uf  [C0603]  17.15 23.37 0 top
C4  10uf  [C0603]  18.67 16.58 270 top
C5  10uf  [C0603]  16.76 16.58 270 top
C6  100nF  [C0603]  31.85 5.46 180 top
C7  100nF  [C0603]  31.85 8.96 180 top
C8  22nF  [C0603]  26.16 8.26 270 top
C9  10uf  [C0603]  11.59 6.73 180 top
C10  100nF  [C0603]  31.85 7.24 180 top
C11  10uf  [C0603]  12.92 16.57 270 top
C12  10uf  [C0603]  14.93 16.57 270 top
C13  22nF  [C0603]  24.08 8.26 270 top
C14  2.2nF  [C0603]  21.97 9.87 270 top
C15  22uF  [C0805]  36.41 18.35 180 top
C16  22nF  [C0603]  24.08 11.39 90 top
C17  22nF  [C0603]  26.16 11.39 90 top
C18  22uF  [C0805]  29.6 24.89 180 top
C19  100nF  [C0603]  34.14 20.62 0 top
C20  100nF  [C0603]  31.85 3.68 180 top
C21  100nF  [C0603]  17.15 21.53 0 top
D1  1N5819WS  [SOD-323_L1.8-W1.3-LS2.5-RD]  28.19 8.06 270 top
D2  1N5819WS  [SOD-323_L1.8-W1.3-LS2.5-RD]  24.91 5.09 180 top
D3  SS54F  [SMAF_L3.5-W2.6-LS4.7-RD-1]  29.86 18.35 180 top
D4  1N5819WS  [SOD-323_L1.8-W1.3-LS2.5-RD]  28.19 11.81 90 top
DEBUG1  -  [Test-Point-0.5mm]  14.5 8.71 0 top
L1  10uH  [L0603]  36.96 9.89 270 top
LED1  LTST-C190KSKT  [LED0603-RD]  5.33 17.26 0 top
LED2  LTST-C190KSKT  [LED0603-RD]  5.33 19.43 0 top
Q1  CJ2301 S1  [SOT-23-3_L3.0-W1.7-P0.95-LS2.9-BR]  11.3 3.81 0 top
Q2  CJ2301 S1  [SOT-23-3_L3.0-W1.7-P0.95-LS2.9-BR]  15.88 4.78 180 top
R1  330R  [R0805]  22.24 15.59 180 top
R2  330R  [R0805]  22.24 17.68 180 top
R3  47k  [R0603]  12 9.14 0 top
R4  1k  [R0603]  2.03 17.32 0 top
R5  47k  [R0603]  14.94 2.03 0 top
R6  120K  [R0603]  34.08 22.35 0 top
R7  1K  [R0603]  2.03 19.44 0 top
R8  10K  [R0603]  34.08 24.16 180 top
SW1  TS-1088R-02026  [SW-SMD_L3.9-W3.0-P4.45]  3.68 23.27 180 top
U1  -  [IP6833]  17.96 9.73 270 top
U2  4.7uH  [IND-SMD_L4.4-W4.2]  24.85 21.84 270 top
U3  MT3608L  [SOT-23-6_L2.9-W1.6-P0.95-LS2.8-BL_3]  29.74 22.11 90 top
USB1  KH-TYPE-C-16P  [USB-C-SMD_KH-TYPE-C-16P]  4.19 10.16 270 top

## Footprints (pads in the part's own frame, mm; a bottom-side part is the same pattern mirrored in y, then rotated)
C0603
  rect 0.8x0.9 smd: 1(-0.7,0) 2(0.7,0)
C0805
  rect 1.41x1.35 smd: 1(-1,0) 2(1,0)
IND-SMD_L4.4-W4.2
  rect 1.4x2.12 smd: 1(2.028,0) 2(-2.028,0)
IP6833
  oval 0.765x0.224 smd: 1(-1.907,1.2) 2(-1.907,0.8) 3(-1.907,0.4) 4(-1.907,0) 5(-1.907,-0.4) 6(-1.907,-0.8) 7(-1.907,-1.2) 15(1.907,-1.2) 16(1.907,-0.8) 17(1.907,-0.4) 18(1.907,0) 19(1.907,0.4) 20(1.907,0.8) 21(1.907,1.2)
  oval 0.224x0.765 smd: 8(-1.2,-1.907) 9(-0.8,-1.907) 10(-0.4,-1.907) 11(0,-1.907) 12(0.4,-1.907) 13(0.8,-1.907) 14(1.2,-1.907) 22(1.2,1.907) 23(0.8,1.907) 24(0.4,1.907) 25(0,1.907) 26(-0.4,1.907) 27(-0.8,1.907) 28(-1.2,1.907)
  rect 2.4x2.4 smd: 29(0,0)
L0603
  rect 0.8x0.864 smd: 1(-0.7,0) 2(0.7,0)
LED0603-RD
  rect 0.8x0.8 smd: 1(-0.799,0) 2(0.799,0)
R0603
  rect 0.806x0.864 smd: 1(-0.753,0) 2(0.753,0)
R0805
  rect 1.133x1.377 smd: 1(-1,0) 2(1,0)
SMAF_L3.5-W2.6-LS4.7-RD-1
  rect 1.6x1.7 smd: 1(-1.96,0) 2(1.96,0)
SOD-323_L1.8-W1.3-LS2.5-RD
  rect 1x0.75 smd: 1(-1.173,0) 2(1.173,0)
SOT-23-3_L3.0-W1.7-P0.95-LS2.9-BR
  rect 1.038x0.532 smd: 1(1.101,-0.95) 2(1.101,0.95) 3(-1.101,0)
SOT-23-6_L2.9-W1.6-P0.95-LS2.8-BL_3
  rect 0.6x1.2 smd: 1(-0.95,-1.3) 2(0,-1.3) 3(0.95,-1.3) 4(0.95,1.3) 5(0,1.3) 6(-0.95,1.3)
SW-SMD_L3.9-W3.0-P4.45
  rect 1.23x1.36 smd: 1(-2.185,0) 2(2.185,0)
Test-Point-0.5mm
  round 0.5 smd: 1(0,0)
USB-C-SMD_KH-TYPE-C-16P
  oval 1x2 hole 0.6x1.7: 1(-4.32,1.765) 2(4.32,1.765)
  oval 1x1.8 hole 0.6x1.4: 3(-4.32,-2.415) 4(4.32,-2.415)
  rect 0.3x1.3 smd: A1(-3.35,2.415) A4(-2.55,2.415) A5(-1.25,2.415) A6(-0.25,2.415) A7(0.25,2.415) A8(1.25,2.415) A9(2.55,2.415) A12(3.35,2.415) B1(3.05,2.415) B4(2.25,2.415) B5(1.75,2.415) B6(0.75,2.415) B7(-0.75,2.415) B8(-1.75,2.415) B9(-2.25,2.415) B12(-3.05,2.415)

## Nets
As in the schematic.

Pads without a net: U1 9 11 13 14 15 18 19 20 21 22; U3 6; USB1 A5 A8 B5 B8

## Via types
v1: diameter 0.61, hole 0.305, Top Layer to Bottom Layer, 91 vias

## Routing (per net, layer and track width the routed paths; a pad name or vN(x,y) marks a point on that pad's centre or on a via; arc(x,y) is an arc through that point)
GND:
  vias: v1(2.9,25.76) v1(2.9,23.22) v1(2.9,15.6) v1(2.9,13.06) v1(2.9,10.52) v1(2.9,7.98) v1(2.9,5.44) v1(2.9,2.9) v1(5.31,18.27) v1(5.44,25.76) v1(5.44,20.68) v1(5.44,15.6) v1(5.44,2.9) v1(7.98,25.76) v1(7.98,20.68) v1(7.98,5.44) v1(7.98,2.9) v1(10.52,25.76) v1(10.52,20.68) v1(12.35,7.87) v1(13.06,20.68) v1(13.06,18.14) v1(13.34,7.75) v1(13.46,6.86) v1(14.22,7.62) v1(14.26,6.86) v1(15.02,7.62) v1(15.09,6.86) v1(15.6,20.68) v1(17.27,10.41) v1(17.96,9.73) v1(18.67,10.41) v1(18.67,9.02) v1(23.22,2.9) v1(25.76,15.6) v1(25.76,2.9) v1(28.3,15.6) v1(28.3,5.44) v1(28.3,2.9) v1(30.84,15.6) v1(32.24,26.39) v1(32.26,25.4) v1(32.38,21.59) v1(32.38,20.12) v1(33.38,15.6) v1(33.53,26.42) v1(33.56,25.4) v1(34.81,26.42) v1(34.8,25.4) v1(35.92,15.6) v1(35.92,5.44) v1(35.92,2.9) v1(38.46,18.14) v1(38.46,15.6) v1(38.46,5.44) v1(38.46,2.9)
VBAT: length 15.3
  Top Layer w0.254: v1(16.38,12.95) 17.16,12.17 U1.6 ; v1(7.32,23.27) SW1.1
  Bottom Layer w0.254: v1(7.32,23.27) 18.75,23.27 v1(19.3,22.72)
  vias: v1(14.22,14.39) v1(15.02,14.39) v1(15.02,13.69) v1(15.62,12.95) v1(15.81,13.69) v1(19.3,23.62) v1(19.3,21.86) v1(19.3,20.94) v1(20.07,23.62) v1(20.07,22.73) v1(20.07,21.86) v1(20.07,20.96)
VBUS: length 42.7
  Top Layer w0.254: U1.3 18.35,11.65 18.35,13.45 18.18,13.63 v1(18.18,14.73)
  Top Layer w0.508: Q1.3 10.16,3.77 v1(10.16,2.03) ; 8.41,7.75 9.4,7.75 10.41,6.73 C9.2 ; 8.41,7.75 6.71,7.75 ; 8.41,7.75 8.51,7.85 8.51,11.94 7.87,12.57 6.55,12.57
  Bottom Layer w0.508: v1(18.18,14.73) 18.18,14.49 21.56,11.1 21.56,1.75 20.64,0.83 11.37,0.83 v1(10.16,2.03)
VCC: length 3.4
  Top Layer w0.254: U1.8 12.69,10.94 C2.2
VDD5V: length 13.1
  Top Layer w0.254: U1.7 15.54,11.64 14.03,13.14 12.72,13.14 C1.2 12.7,13.33 11.43,14.61 8.79,14.61 LED1.2
AC1: length 2.3
  Top Layer w0.254: U1.25 21.41,9.73 C14.2
AC2: length 2.3
  Top Layer w0.254: C14.1 21.54,10.14 U1.26
BST1: length 4.9
  Top Layer w0.254: C13.2 22.29,7.56 20.51,9.34 U1.24
BST2: length 4.9
  Top Layer w0.254: U1.27 19.88,10.53 20.43,10.53 21.99,12.09 24.08,12.09
CMM1: length 10
  Top Layer w0.254: U1.23 20.4,8.94 22.61,6.73 25.34,6.73 C8.2 26.16,5.16 D2.1
CMM2: length 7.5
  Top Layer w0.254: 26.16,12.09 25.29,12.95 22.36,12.95 20.34,10.94 U1.28
DM: length 16.4
  Top Layer w0.254: U1.16 17.16,7.26 16.76,6.86 v1(16.13,6.86) ; USB1.B7 7.5,10.91 7.75,10.67 7.75,10.16 7.5,9.91 USB1.A7
  Bottom Layer w0.254: v1(7.75,10.44) 8.3,10.44 10.41,8.33 10.41,6.6 11.05,5.97 15.24,5.97 v1(16.13,6.86)
DP: length 18.4
  Top Layer w0.254: U1.17 17.56,6.9 v1(16.94,6.27) ; USB1.A6 5.58,10.41 5.46,10.29 5.46,9.65 5.7,9.41 USB1.B6
  Bottom Layer w0.254: v1(16.94,6.27) 16.25,5.59 10.79,5.59 6.47,9.92 v1(5.46,9.92)
EN: length 3.7
  Top Layer w0.254: 12.75,9.14 13.72,9.14 14.71,10.14 U1.10
PGATE: length 32.4
  Top Layer w0.254: U1.4 17.96,11.65 17.96,13.35 17.46,13.85 v1(17.46,14.35)
  Top Layer w0.508: v1(20.07,2.16) 18.67,0.76 15.56,0.76 14.28,2.03 R5.1 13.23,2.03 Q1.1 12.25,2.86 11.3,3.81 11.3,5.08 11.94,5.72 14.76,5.72 Q2.1
  Bottom Layer w0.508: v1(17.46,14.35) 20.83,10.98 20.83,2.92 v1(20.07,2.16)
VOUT: length 30.4
  Top Layer w0.254: U1.5 17.56,13.24 C12.2 C11.2 v1(11.69,15.87) 10.54,15.87 6.99,19.43 LED2.2
  Bottom Layer w0.508: v1(10.79,15.87) 10.79,15.87 10.79,12.95 12.82,10.92 14.48,10.92 19.06,6.34 v1(19.06,5.46)
  vias: v1(10.79,17.4) v1(10.79,16.6) v1(18.16,5.46) v1(18.16,4.7) v1(18.16,3.94) v1(19.06,4.7) v1(19.06,3.94)
VRECT: length 11
  Top Layer w0.254: R2.2 R1.2 20.95,15.88 C4.2 ; C4.2 18.76,15.78 U1.2 ; C4.2 C5.2
$1N1926: length 9.2
  Top Layer w0.254: U1.1 19.16,13.07 19.93,13.84 22.48,13.84 23.24,14.61 R1.1 R2.1
$1N1936: length 1.8
  Top Layer w0.254: U1.12 15.12,9.34 DEBUG1.1
$1N1962: length 5.4
  Top Layer w0.508: Q1.2 13.02,4.76 13.95,3.83 Q2.2 15.48,3.83 15.75,3.56 15.75,2.09 15.69,2.03
$1N1968: length 1.8
  Top Layer w0.254: R7.2 4.53,19.44 LED2.1
$1N1977: length 1.8
  Top Layer w0.254: LED1.1 4.48,17.32 R4.2
$1N1994: length 4.4
  Top Layer w0.254: U3.3 31.81,23.06 32.51,22.35 R6.1 R8.2
$1N3112: length 21.8
  Top Layer w0.254: v1(1.52,21.34) 1.52,23.25 SW1.2 ; R3.1 v1(11.24,8)
  Bottom Layer w0.254: v1(11.24,8) 7.05,12.19 4.7,12.19 3.94,12.95 3.94,18.92 v1(1.52,21.34)

## Copper pours and planes (outline as drawn; the poured copper is in the pictures)
8V on Top Layer: 31.12,19.43 34,19.43 34.15,19.58 34.15,22.85 34.42,23.11 38.74,23.11 38.99,22.86 38.99,19.81 38.74,19.56 36.74,19.56 36.41,19.22 36.41,17.48 36.07,17.15 31.07,17.15 30.75,17.46 30.75,19.07
GND on Top Layer: -5.21,36.07 50.8,36.07 50.8,-8.76 -5.21,-8.76
GND on Bottom Layer: -8.38,34.54 56.39,34.54 56.39,-14.99 -8.38,-14.99
VBAT on Top Layer: 29.6,21.98 29.21,21.59 27.81,21.59 27.31,22.1 27.31,22.61 26.8,23.11 22.35,23.11 20.7,24.77 17.4,24.77 17.15,25.02 17.15,27.31 29.21,27.31 29.6,26.91
VBAT on Top Layer: 17.15,20.53 17.15,25.04 17.46,25.35 19.86,25.35 20.45,24.77 20.45,20.57 20.07,20.19 17.49,20.19
VBAT on Top Layer: 13.72,14.99 15.24,14.99 17.02,13.21 17.02,12.45 16.89,12.32 15.49,12.32 13.46,14.35 13.46,14.73
VBAT on Bottom Layer: 13.84,12.32 13.34,12.83 13.34,15.35 18.62,20.64 18.62,23.7 19.05,24.13 20.45,24.13 20.83,23.75 20.83,20.21 16.91,16.3 16.91,12.65 16.58,12.32
VBUS on Top Layer: 9.53,3.43 9.65,3.3 10.67,3.3 10.79,3.43 10.79,5.21 11.43,5.84 11.43,7.24 11.14,7.62 9.93,7.62 9.53,7.23
AC1 on Top Layer: 31.74,3.04 31.5,2.79 30.53,2.79 30.26,3.06 30.26,7.4 29.62,8.04 28.79,8.04 28.57,8.26 28.57,9.53 28.78,9.79 31.74,9.78
AC1 on Top Layer: 28.78,9.79 29.29,9.28 29.29,8.39 29.28,8.39 28.87,7.99 27.66,7.99 27.13,8.52 21.41,8.52 21,9.54 21,9.79
AC2 on Top Layer: 38.86,10.03 38.86,13.34 30.35,13.34 28.57,11.56 28.57,10.03
AC2 on Top Layer: 28.83,10.03 29.34,10.54 29.34,11.43 29.33,11.43 28.92,11.84 27.71,11.84 27.18,11.3 21.46,11.3 21.06,10.29 21.06,10.03
VOUT on Top Layer: 11.43,17.78 11.43,17.15 12.06,16.51 15.25,16.51 15.49,16.27 15.49,15.31 10.35,15.31 10.04,15.62 10.04,17.66 10.41,18.03 11.18,18.03
VOUT on Top Layer: 17.08,5.27 17.91,6.1 19.18,6.1 19.69,5.78 19.69,3.75 19.28,3.27 16.79,3.27 16.26,3.81 16.26,5.08 16.45,5.27
VOUT on Bottom Layer: 17.66,6.14 19.77,6.14 20.06,5.85 20.06,3.57 19.75,3.26 17.63,3.26 17.41,3.48 17.41,5.89
VOUT on Bottom Layer: 9.91,18.16 12.02,18.16 12.3,17.87 12.3,15.59 11.99,15.28 9.87,15.28 9.65,15.49 9.65,17.91
$1N1945 on Top Layer: 38.86,9.78 38.86,6.86 34.29,6.86 33.53,6.1 33.53,3.18 33.15,2.79 32.23,2.79 31.98,3.05 31.98,9.5 32.26,9.78
$1N1985 on Top Layer: 23.7,20.53 23.5,20.32 23.5,19.18 25.4,17.27 28.7,17.27 29.21,17.78 29.21,18.92 30.23,19.94 31.37,19.94 31.88,20.45 31.88,21.27 31.56,21.59 30.35,21.59 29.29,20.53

Small or netless copper shapes (teardrops, artwork), in the pictures only: 71 on Top Layer, 11 on Bottom Layer

## Text on the board
Bottom Silkscreen Layer: BAT | AC | 8V
Top Silkscreen Layer: 8V | BAT | AC
